# EAGLE design main_board (EAGLE 7.2.0)
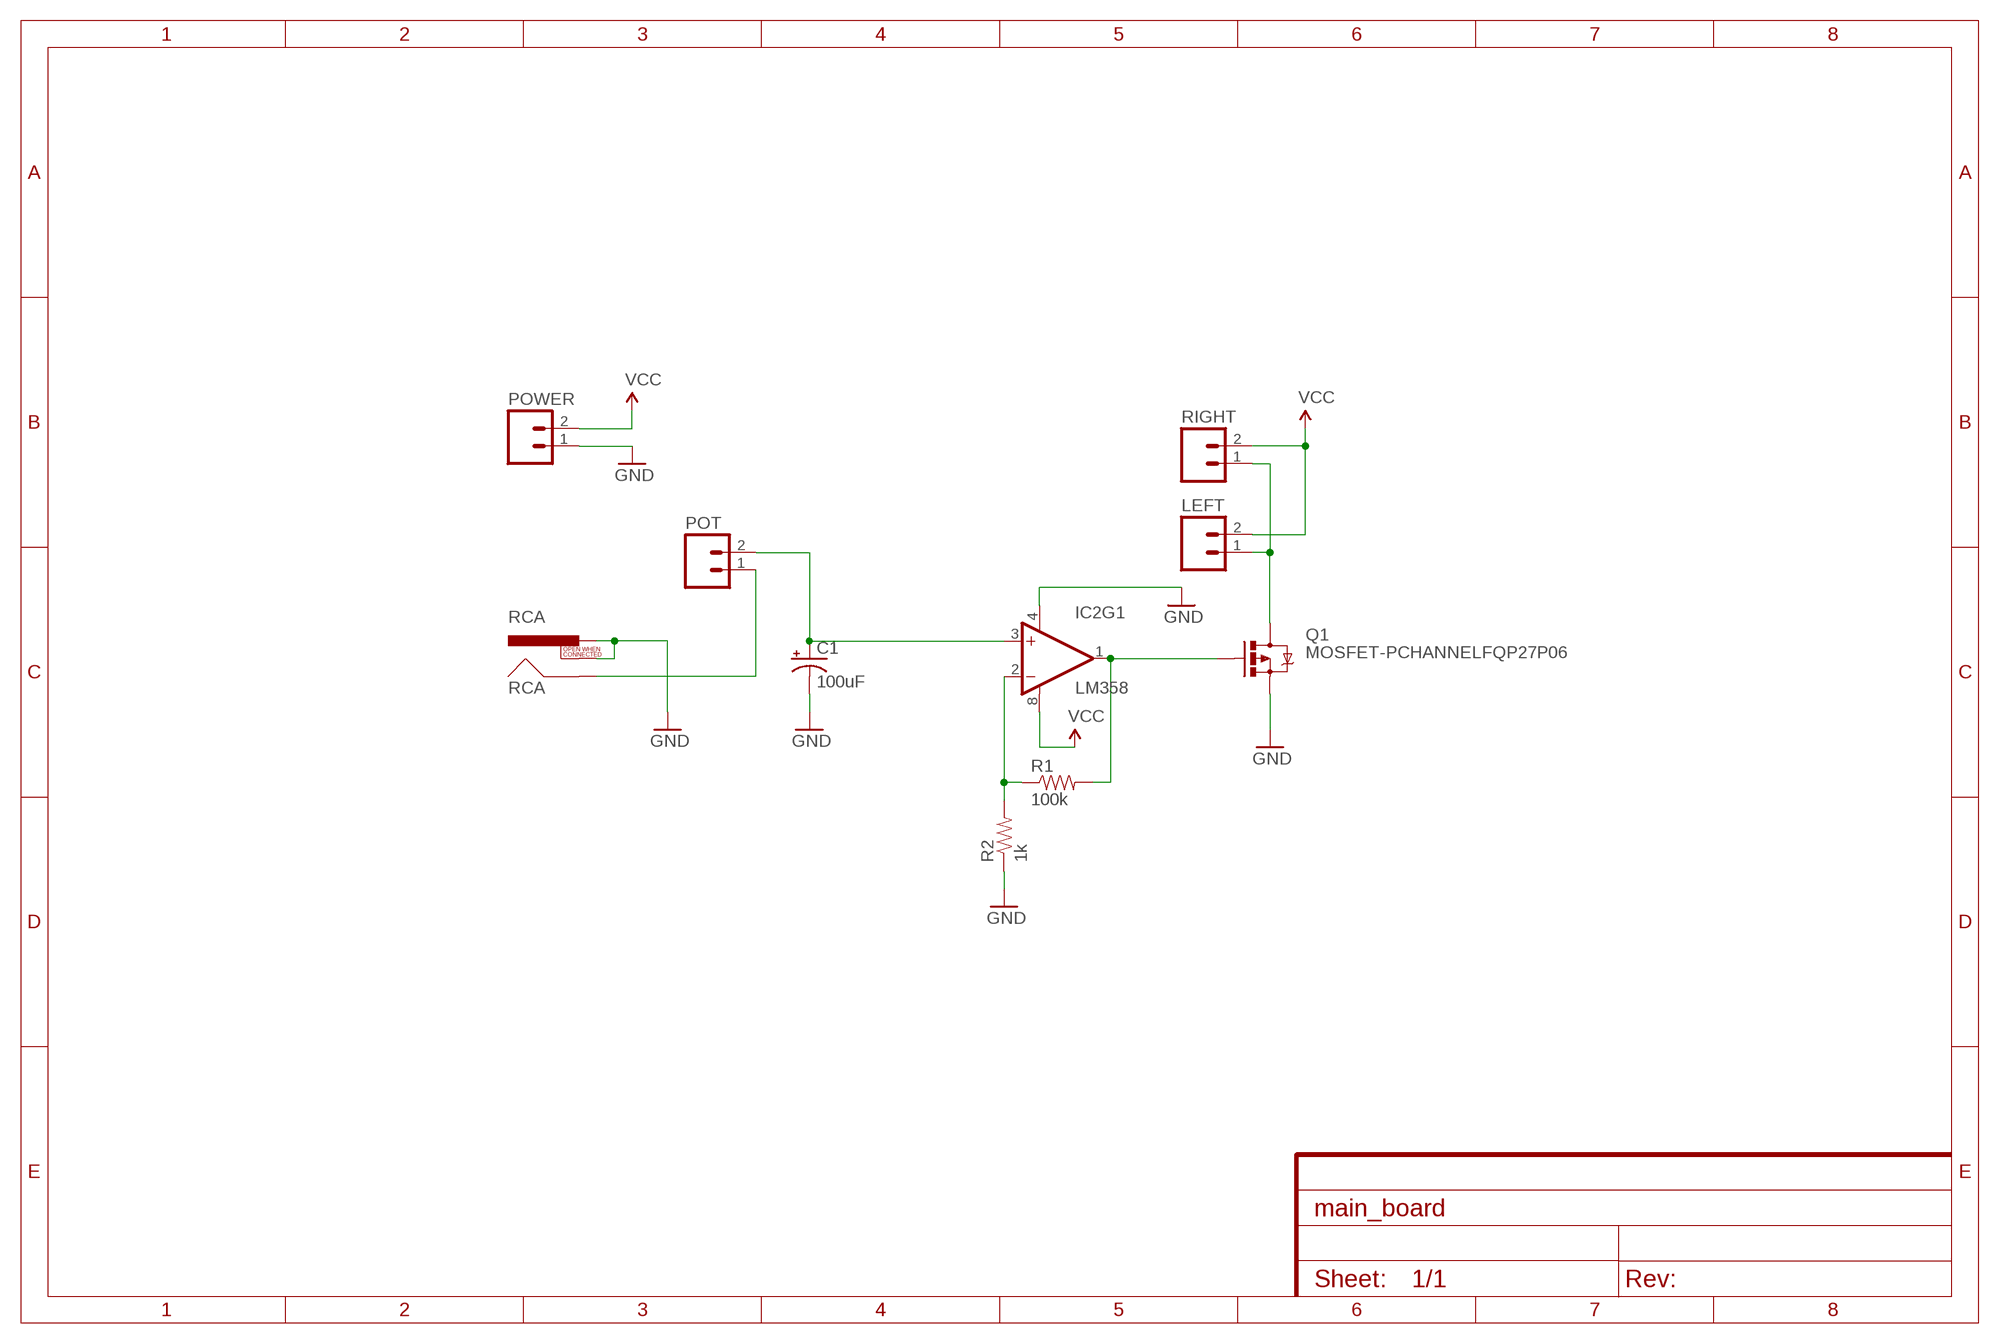
[diagram p0: schematic, sheet 1]

## Parts
C1  100uF  CAP_POLPTH1  [CPOL-RADIAL-100UF-25V]
IC2  LM358  [DIP08]
LEFT  M02PTH  [1X02]
POT  M02PTH  [1X02]
POWER  M02PTH  [1X02]
Q1  MOSFET-PCHANNELFQP27P06  [TO220V]
R1  100k  RESISTORKIT  [AXIAL-0.3-KIT]
R2  1k  RESISTORKIT  [AXIAL-0.3-KIT]
RCA  RCA  [RCA]
RIGHT  M02PTH  [1X02]

## Nets
AUDIO_SIGNAL: POT.1 RCA.SHELL
GND: C1.2(-) IC2.4(V-) POWER.1 Q1.3(S) R2.P$1 RCA.PIN RCA.SWITCH
N$1: C1.1(+) IC2.3(+IN) POT.2
N$2: IC2.1(OUT) Q1.1(G) R1.P$2
N$3: IC2.2(-IN) R1.P$1 R2.P$2
N$4: LEFT.1 Q1.2(D) RIGHT.1
VCC: IC2.8(V+) LEFT.2 POWER.2 RIGHT.2
Unconnected: IC2.5(+IN) IC2.6(-IN) IC2.7(OUT)

## Library data of the parts
C1 = SparkFun-Passives:CAP_POL: Capacitor Polarized These are standard SMD and PTH capacitors. Normally 10uF, 47uF, and 100uF in electrolytic and tantalum varieties. Always verify the external diameter of the through hole cap, it varies with capacity, voltage, and manufacturer. The EIA devices should be standard.
IC2 = SparkFun-AnalogIC:LM358: Jellybean op-amp; PROD_ID: IC-09172
LEFT POT POWER RIGHT = SparkFun-Connectors:M02: Standard 2-pin 0.1" header. Use with - straight break away headers ( PRT-00116) - right angle break away headers (PRT-00553) - swiss pins (PRT-00743) - machine pins (PRT-00117) - female headers (PRT-00115) Molex polarized connector foot print use with: PRT-08233 with associated crimp pins and housings. 2.54_SCREWTERM for use with PRT-10571. 3.5mm Screw Terminal footprints for PRT-08084 5mm Screw Terminal footprints for use with PRT-08432
Q1 = SparkFun-DiscreteSemi:MOSFET-PCHANNEL: Generic PMOSFET IRLML2244 - TRANS-11153 (SOT-23 -20V -4.3A) (1.Gate 2.Source 3.Drain) FQP27P06 - COM-10349 <http://www.sparkfun.com/products/10349> (TO-220 -60V -27A) (1.Gate 2.Source 3.Drain)
R1 R2 = SparkFun-Passives:RESISTOR: Resistor Basic schematic elements and footprints for 0603, 1206, and PTH resistors.
RCA = SparkFun-Connectors:RCA

## Board
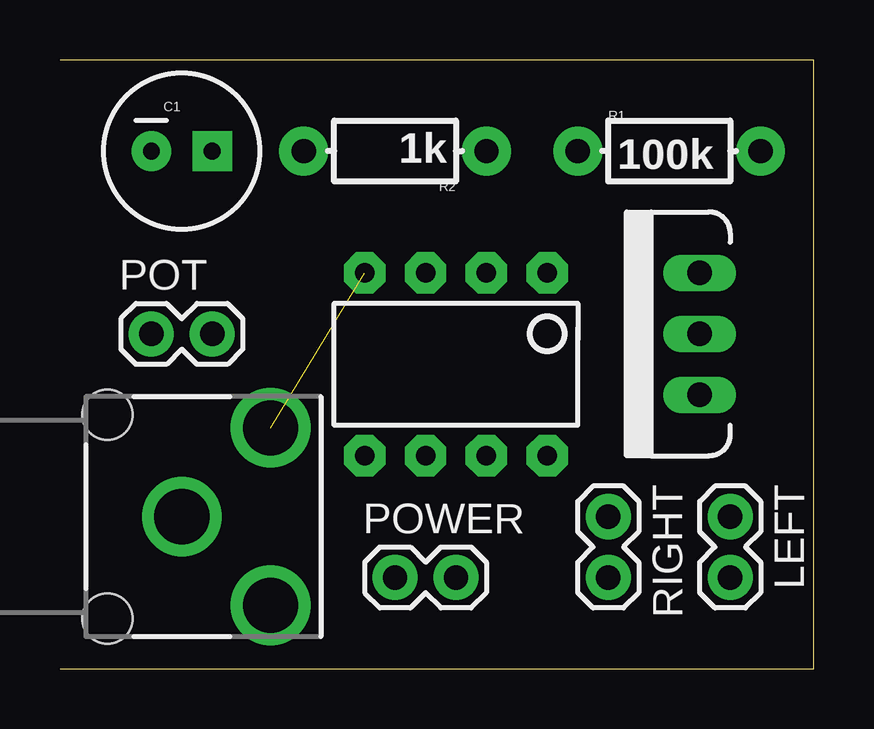
[diagram p1: board, top side]
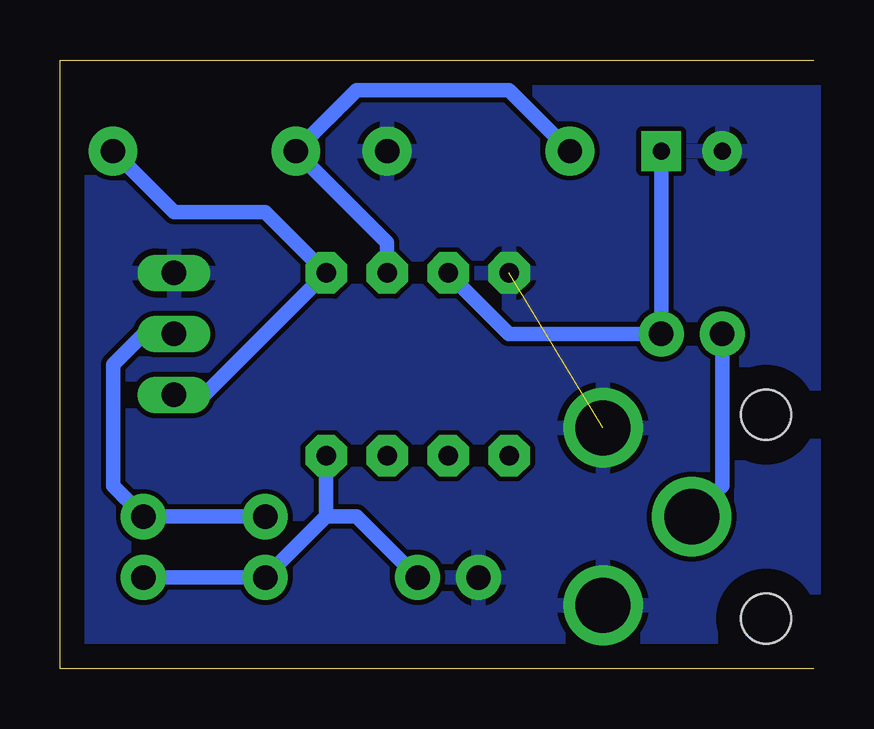
[diagram p2: board, bottom side, seen from below]

Size 31.42 x 25.39 mm. Coordinates in mm from the lower left corner, seen from the top.
Outline: 0,0 31.42,0 31.42,25.39 0,25.39
Copper layers (1*16): Top 0.035mm / dielectric 1.5mm / Bottom 0.035mm
Design rules "default": minimum track width 10mil, minimum drill 24mil, track to track 8mil, track to pad 8mil, pad to pad 8mil, via to via 8mil, smd to smd 8mil, copper to edge 40mil, drill to drill 8mil, minimum pad ring 10mil, minimum via ring 8mil, stop-mask expansion 4mil, vias tented up to drill 0mil, thermal gap 10mil

### Footprints (pad centres in the part's own frame; a part is rotated, then mirrored left to right if it is on the bottom)
CPOL-RADIAL-100UF-25V = drill 0.7 pad 1.651 square: 1 1.27,0 | drill 0.7 pad 1.651: 2 -1.27,0
DIP08 = drill 0.813 pad 1.727 octagon: 1 -3.81,-3.81; 2 -1.27,-3.81; 3 1.27,-3.81; 4 3.81,-3.81; 5 3.81,3.81; 6 1.27,3.81; 7 -1.27,3.81; 8 -3.81,3.81
1X02 = drill 1.016 pad 1.88: 1 0,0; 2 2.54,0
TO220V = drill 1.016 long: 1 -2.54,0; 2 0,0; 3 2.54,0
AXIAL-0.3-KIT = drill 1.016 pad 2.032: P$1 -3.81,0; P$2 3.81,0
RCA = drill 2.3: PIN 3.7,3.7; SHELL 0,0; SWITCH 3.7,-3.7 | hole 2.1: -3.1,4.25; -3.1,-4.25

### Placement (x,y rotation side)
C1  5.08,21.59 0 top
IC2  16.51,12.7 180 top
LEFT  27.94,6.35 270 top
POT  3.81,13.97 0 top
POWER  13.97,3.81 0 top
Q1  26.67,13.97 90 top
R1  25.4,21.59 0 top
R2  13.97,21.59 180 top
RCA  5.08,6.35 0 top
RIGHT  22.86,6.35 270 top

### Tracks (layer width: path | path; a pad name or v marks a point on that pad's centre or on a via)
AUDIO_SIGNAL
  Bottom 0.61: RCA.SHELL 3.81,7.62 POT.1
GND  (1 unrouted)
  pour Bottom: 0,0 0,25.4 31.75,25.4 31.75,0
N$1
  Bottom 0.61: C1.1 POT.2 12.7,13.97 IC2.3
N$2
  Bottom 0.61: R1.P$2 26.67,19.05 22.86,19.05 IC2.1 25.4,11.43 Q1.1
N$3
  Bottom 0.61: IC2.2 17.78,17.78 R1.P$1 19.05,24.13 12.7,24.13 R2.P$2
N$4
  Bottom 0.61: Q1.2 27.94,13.97 29.21,12.7 29.21,7.62 LEFT.1 RIGHT.1
VCC
  Bottom 0.61: POWER.2 19.05,6.35 20.32,6.35 | 20.32,6.35 IC2.8 | 20.32,6.35 RIGHT.2 LEFT.2